# EAGLE design RFM69W-V1.0 (EAGLE 6.6.0)
ABBREV: rf1; PROJECT: RFM12B Board
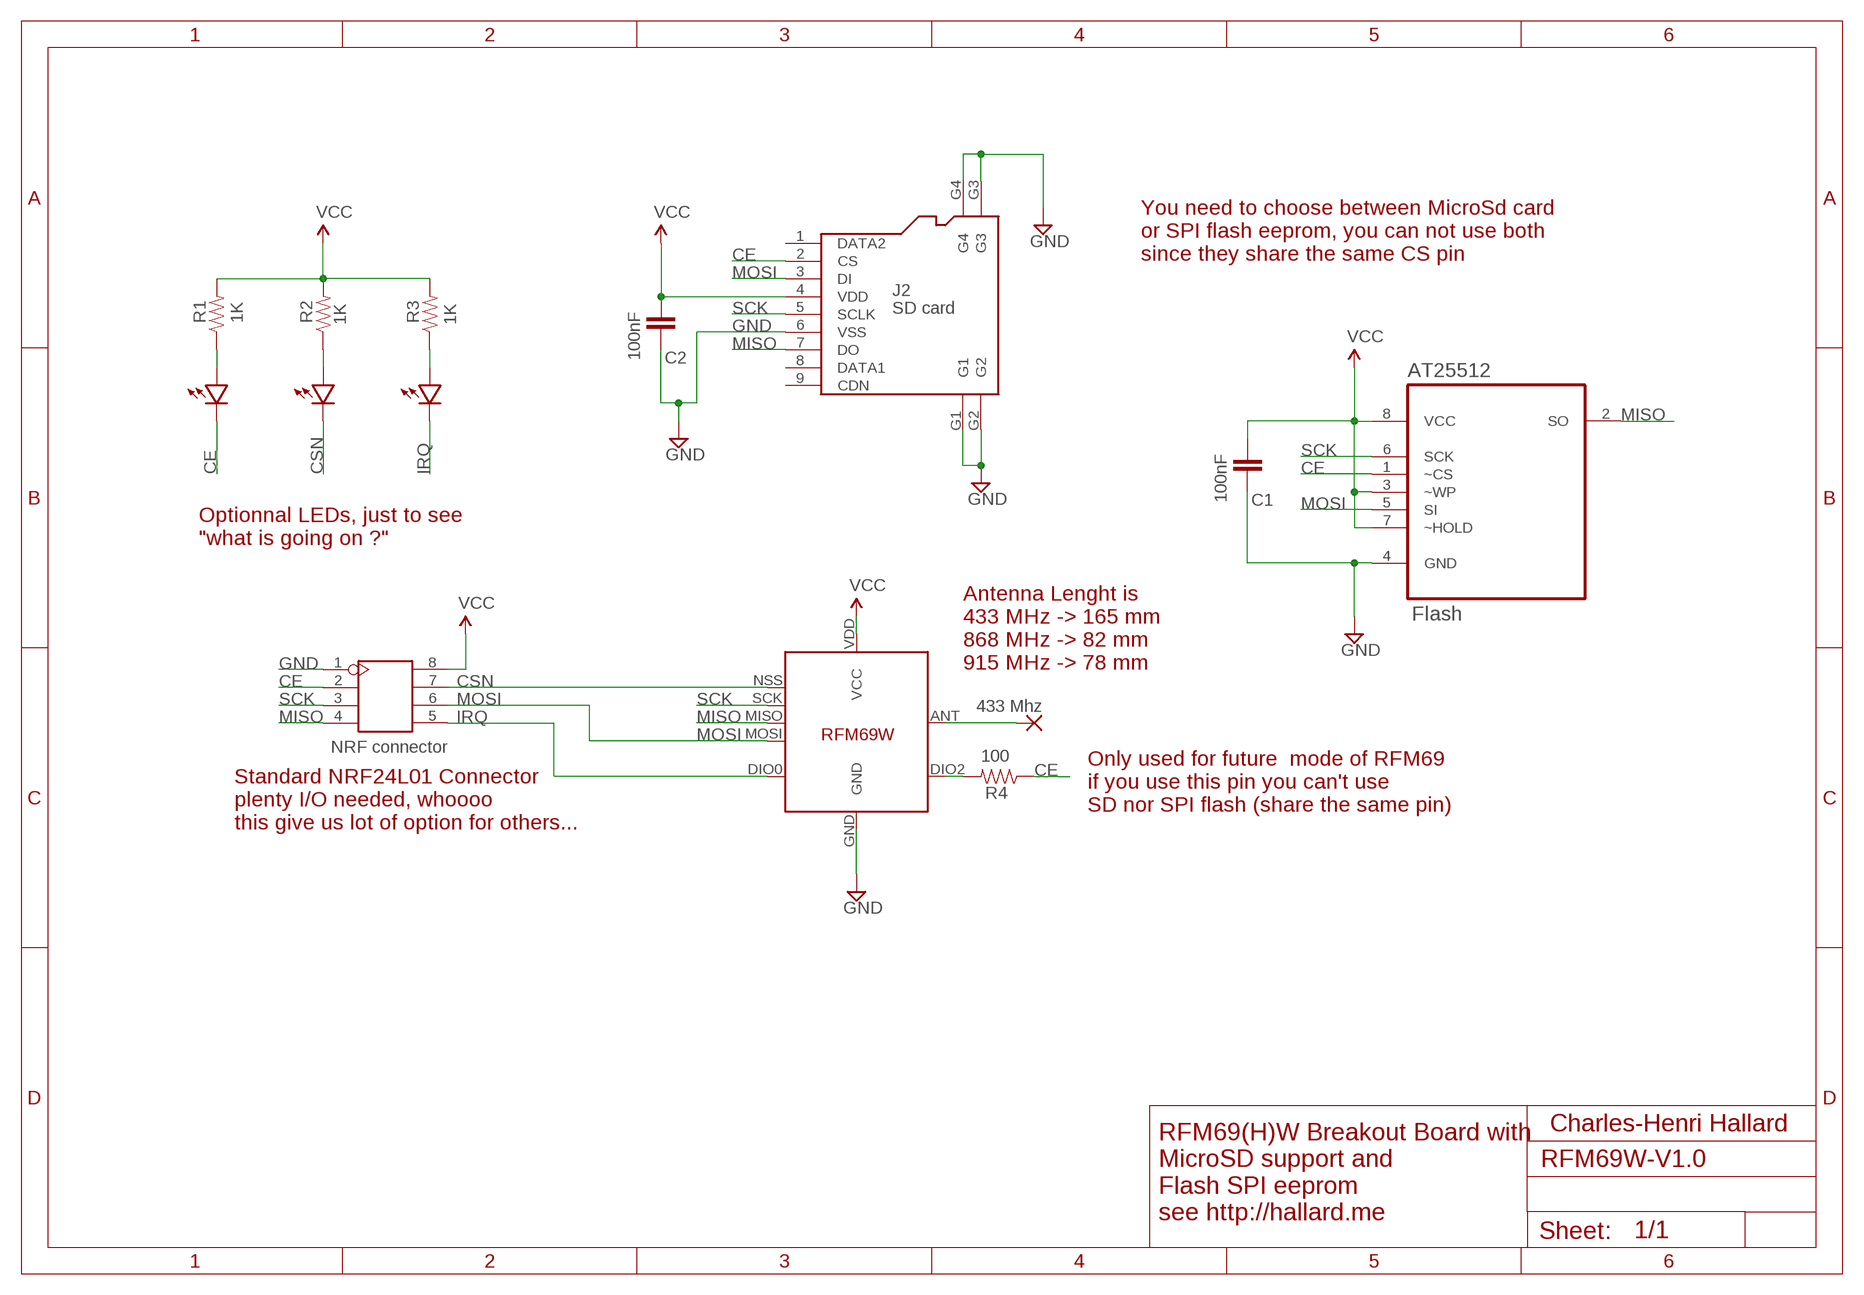
[diagram p0: schematic, sheet 1]

## Parts
ANT.  433 Mhz  1,6/0,8  [1,6/0,8]
AT25512  Flash  AT25512N-SH-B  [SOIC127P600X175-8N]
C1  100nF  CAP0805-CAP  [0805-CAP]
C2  100nF  CAP0805-CAP  [0805-CAP]
J1  NRF connector  HEADER-2X4P-2.54  [2X4P-2.54]
J2  SD card  HOLDER-MICROSD-9P  [9P-SMD-W/-RING]
R1  1K  RESISTOR0805-RES  [0805-RES]
R2  1K  RESISTOR0805-RES  [0805-RES]
R3  1K  RESISTOR0805-RES  [0805-RES]
R4  100  RESISTOR0805-RES  [0805-RES]
U$1  RFM69  [RFM69W-MINPADS]
U$2  LED0805-LARGE  [0805-LED-LARGEPADS]
U$3  LED0805-LARGE  [0805-LED-LARGEPADS]
U$4  LED0805-LARGE  [0805-LED-LARGEPADS]

## Nets
CE: AT25512.1(~CS) J1.2 J2.2(CS) R4.1 U$2.MINUS
CSN: J1.7 U$1.NSS(SEL) U$3.MINUS
GND [power]: AT25512.4(GND) C1.2 C2.2 J1.1 J2.6(VSS) J2.G1 J2.G2 J2.G3 J2.G4 U$1.GND
IRQ: J1.5 U$1.DIO0 U$4.MINUS
MISO: AT25512.2(SO) J1.4 J2.7(DO) U$1.MISO
MOSI: AT25512.5(SI) J1.6 J2.3(DI) U$1.MOSI
N$1: ANT..1(P) U$1.ANT
N$2: R1.1 U$2.PLUS
N$3: R2.1 U$3.PLUS
N$5: R3.1 U$4.PLUS
N$6: R4.2 U$1.DIO2
SCK: AT25512.6(SCK) J1.3 J2.5(SCLK) U$1.SCK
VCC [power]: AT25512.3(~WP) AT25512.7(~HOLD) AT25512.8(VCC) C1.1 C2.1 J1.8 J2.4(VDD) R1.2 R2.2 R3.2 U$1.VDD(VCC)
Unconnected: J2.1(DATA2) J2.8(DATA1) J2.9(CDN)

## Notes on the sheet
- You need to choose between MicroSd card
  or SPI flash eeprom, you can not use both
  since they share the same CS pin
- Optionnal LEDs, just to see
  "what is going on ?"
- Antenna Lenght is
  433 MHz -> 165 mm
  868 MHz -> 82 mm
  915 MHz -> 78 mm
- Only used for future  mode of RFM69
  if you use this pin you can't use 
  SD nor SPI flash (share the same pin)
- Standard NRF24L01 Connector
  plenty I/O needed, whoooo
  this give us lot of option for others...
- Charles-Henri Hallard
- RFM69(H)W Breakout Board with
  MicroSD support and
  Flash SPI eeprom
  see http://hallard.me

## Library data of the parts
ANT. = JeeLabs:1,6/0,8: THROUGH-HOLE PAD
AT25512 = Atmel_By_element14_Batch_1:AT25512N-SH-B: SPI Serial EEPROM; MPN: AT25512N-SH-B; OC_FARNELL: 1841581; OC_NEWARK: 12T1360; PACKAGE: SOIC-8; SUPPLIER: Atmel
C1 C2 = _c2h:CAP: Capacitor Standard 0603 ceramic capacitor, and 0.1" leaded capacitor.
J1 = Seeed-Connector:HEADER-2X4P
J2 = Connector:HOLDER-MICROSD-9P
R1-R4 = _c2h:RESISTOR: Resistor Basic schematic elements and footprints for 0603, 1206, and PTH resistors.
U$1 = RFM69W:RFM69
U$2-U$4 = _c2h:LED

## Net classes
1 power: width 0.203 mm, drill 0.305 mm, clearance 0.152 mm

## Board
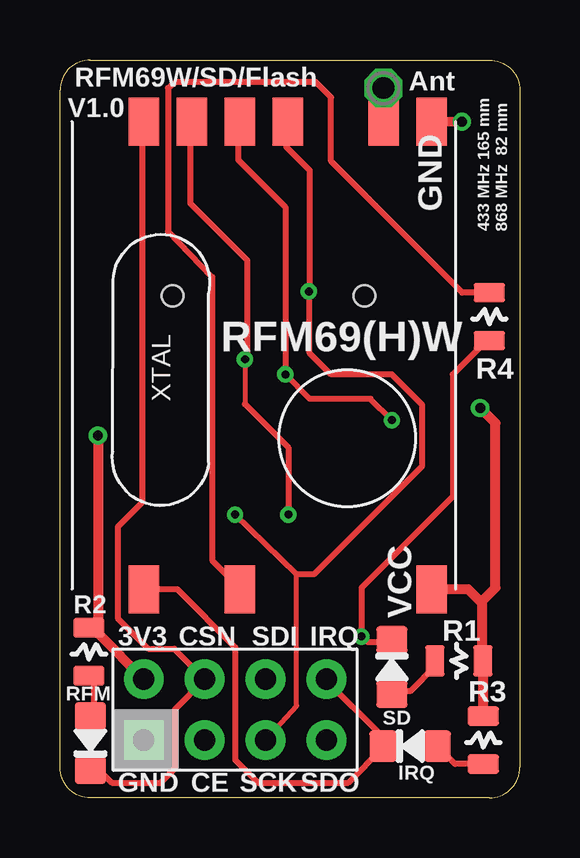
[diagram p1: board, top side]
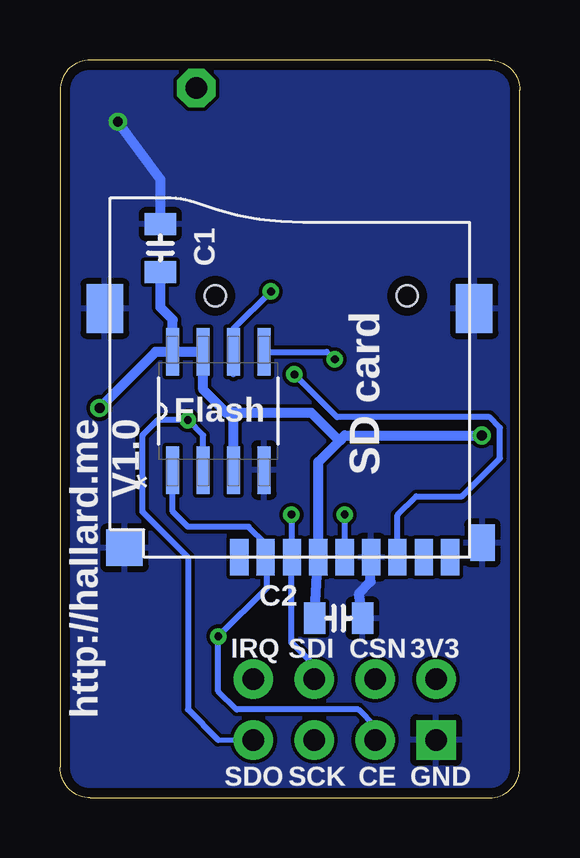
[diagram p2: board, bottom side, seen from below]

Size 19.18 x 30.77 mm. Coordinates in mm from the lower left corner, seen from the top.
Outline: 1.27,30.77 arc90 0,29.5 0,1.27 arc90 1.27,0 17.91,0 arc90 19.18,1.27 19.18,29.5 arc90 17.91,30.77 1.24,30.77
Copper layers (1*16): Top 0.0356mm / dielectric 1.5011mm / Bottom 0.0356mm
Design rules "LaenPCBOrder *": minimum track width 6mil, minimum drill 13mil, track to track 6mil, track to pad 6mil, pad to pad 6mil, via to via 6mil, smd to smd 6mil, copper to edge 15mil, drill to drill 6mil, minimum pad ring 7mil, minimum via ring 7mil, stop-mask expansion 3mil, vias tented up to drill 40mil, thermal gap 10mil

### Footprints (pad centres in the part's own frame; a part is rotated, then mirrored left to right if it is on the bottom)
1,6/0,8 = drill 0.9 pad 1.6 octagon: 1 0,0
SOIC127P600X175-8N = smd 1.981 x 0.559: 1 -2.464,1.905; 2 -2.464,0.635; 3 -2.464,-0.635; 4 -2.464,-1.905; 5 2.464,-1.905; 6 2.464,-0.635; 7 2.464,0.635; 8 2.464,1.905
0805-CAP = smd 0.902 x 1.3: 1 -1,0; 2 1,0
2X4P-2.54 = drill 0.889 pad 1.651 square: 1 -1.27,3.81 | drill 0.889 pad 1.651: 2 -1.27,1.27; 3 -1.27,-1.27; 4 -1.27,-3.81; 5 1.27,-3.81; 6 1.27,-1.27; 7 1.27,1.27; 8 1.27,3.81
9P-SMD-W/-RING = smd 1.524 x 0.762: 1 0,4.4; 2 0,3.3; 3 0,2.2; 4 0,1.1; 5 0,0; 6 0,-1.1; 7 0,-2.2; 8 0,-3.3; 9 0,-4.4 | smd 1.524 x 1.016: G1 0.6,-5.746 | smd 2.032 x 1.524: G2 10.373,-5.4; G3 10.373,10 | smd 1.524 x 1.524: G4 0.392,9.181 | hole 0.889: 10.9,-2.6; 10.9,5.4
0805-RES = smd 0.8 x 1.3: 1 -1,0; 2 1,0
RFM69W-MINPADS = smd 2 x 1.27: ANT 8,-5; DIO0 -11.5,5; DIO2 -11.5,1; GND 8,-7; MISO 8,1; MOSI 8,3; NSS 8,5; SCK 8,-1; VDD -11.5,-7
0805-LED-LARGEPADS = smd 1.156 x 1.3: MINUS -1.127,0; PLUS 1.127,0

### Placement (x,y rotation side)
ANT.  13.49,29.59 0 top
AT25512  12.57,16.13 90 bottom
C1  14.99,22.92 90 bottom
C2  7.56,7.49 0 bottom
J1  7.3,3.68 90 top
J2  7.3,10.03 90 bottom
R1  16.64,5.71 0 top
R2  1.21,6.1 90 top
R3  17.65,2.41 90 top
R4  17.91,20.07 90 top
U$1  8.51,20.19 90 top
U$2  13.84,5.46 270 top
U$3  1.27,2.29 90 top
U$4  14.6,2.16 0 top

### Tracks (layer width: path | path; a pad name or v marks a point on that pad's centre or on a via)
CE  (via drill 0.33)
  Top 0.203: 12.79,6.51 v12.57,6.73
  Top 0.254: R4.1 17.85,19.12 16.38,17.65 16.38,12.57 12.57,8.76 v12.57,6.73 | 12.79,6.51 13.84,6.51 U$2.MINUS
  Bottom 0.203: 10.54,9.97 J2.2 10.6,10.6 | J1.2 6.03,2.98
  Bottom 0.254: 10.54,9.97 10.54,8.76 v12.57,6.73 12.57,4.45 11.81,3.68 6.73,3.68 6.03,2.98 | 10.6,10.6 11.3,11.3 13.84,11.3 14.48,11.94 AT25512.1
CSN
  Top 0.203: 3.45,28.13 U$1.NSS
  Top 0.254: 3.45,28.13 3.45,12.34 2.41,11.3 2.41,7.49 3.68,6.22 4.76,6.22 J1.7 4.79,3.68 4.79,1.24 4.19,0.64 2.16,0.64 1.69,1.11 1.61,1.03 U$3.MINUS
GND  (via drill 0.41)
  Top 0.406: v16.76,28.19 15.49,28.18 U$1.GND
  Bottom 0.203: 5.97,9.52 5.97,9.8 J2.6
  Bottom 0.406: C2.2 6.71,8.53 6.22,9.02 6.22,10.01 J2.6 | C1.2 14.99,25.78 v16.76,28.19
  pour Bottom: -1.14,-1.14 -1.14,31.93 20.32,31.93 20.32,-1.14
IRQ
  Top 0.203: J1.5 11.11,4.89 | 13.33,2.67 13.33,2.38
  Top 0.254: 11.11,4.89 13.33,2.67 | U$1.DIO0 4.9,8.69 7.3,6.29 7.3,1.59 8.25,0.64 12.03,0.64 13.48,2.08 U$4.MINUS 13.48,2.24 13.33,2.38
MISO  (via drill 0.33)
  Top 0.203: 7.45,28.13 U$1.MISO
  Top 0.254: v13.84,15.75 12.95,16.64 10.41,16.64 v9.4,17.65 9.4,24.64 7.45,26.59 7.45,28.13
  Bottom 0.203: 5.08,10.01 J2.7 | 12.57,2.41 J1.4
  Bottom 0.254: AT25512.2 13.21,15.11 v13.84,15.75 15.11,15.75 15.75,15.11 15.75,11.94 13.84,10.03 13.84,3.68 12.57,2.41 | J2.7 5.1,11.79 4.32,12.57 2.41,12.57 0.83,14.16 0.83,15.43 1.27,15.87 7.62,15.87 v9.4,17.65
MOSI  (via drill 0.33)
  Top 0.203: 7.72,16.41 v7.72,18.29 7.81,18.38 | 5.45,28.13 U$1.MOSI
  Top 0.254: 7.72,16.41 9.52,14.6 v9.52,11.81 | 7.81,18.38 7.81,22.42 5.45,24.78 5.45,28.13
  Bottom 0.203: 9.52,10.01 J2.3 9.52,10.05 | 8.05,18.59 v7.72,18.29
  Bottom 0.254: J1.6 8.57,5.53 9.52,6.48 9.52,10.01 | v9.52,11.81 9.52,10.05 | AT25512.5 8.05,18.59
N$1
  Top 0.203: 13.49,28.55 13.3,27.99 | 13.3,27.99 13.18,27.59 | 13.49,28.24 13.49,28.17 13.3,27.99
  Top 0.254: ANT..1 13.49,28.24 13.49,28.21 U$1.ANT
N$2
  Top 0.203: R1.1 15.69,5.53
  Top 0.254: 15.69,5.53 14.6,4.45 13.88,4.45 13.88,4.33 U$2.PLUS
N$3
  Top 0.254: R2.1 1.4,4.78 1.4,3.41 U$3.PLUS
N$5
  Top 0.254: 15.87,2.16 U$4.PLUS 16.48,1.41 R3.1
N$6
  Top 0.254: U$1.DIO2 7.49,8.71 7.49,8.76 6.35,9.91 6.35,21.72 4.51,23.62 4.51,29.59 4.83,29.85 10.67,29.85 11.3,29.21 11.3,26.54 16.78,21.07 R4.2
SCK  (via drill 0.33)
  Top 0.203: J1.3 9.87,3.84 9.87,9.33 | 9.44,27.13 9.44,28.13 U$1.SCK
  Top 0.254: 9.44,27.13 10.41,26.16 10.41,21.15 v10.38,21.11 10.41,21.08 10.41,18.54 11.3,17.65 13.84,17.65 15.11,16.38 15.11,13.84 10.6,9.33 9.87,9.33 v7.3,11.81
  Bottom 0.203: AT25512.6 11.94,19.56
  Bottom 0.254: v7.3,11.81 J2.5 | 11.94,19.56 v10.38,21.11 | AT25512.6 11.94,17.65
VCC  (via drill 0.41)
  Top 0.203: R2.2 1.14,7.05 1.59,7.49
  Top 0.406: v1.59,15.11 1.59,7.49 1.59,6.86 J1.8 | v17.53,16.26 18.16,15.62 18.16,8.76 17.59,8.19 17.59,8.13 | 17.59,3.43 R3.2 17.64,3.43 R1.2 17.59,5.77 17.59,8.13 | 17.59,8.13 17.02,8.69 U$1.VDD
  Bottom 0.406: 7.53,14.89 8.4,14.01 J2.4 C2.1 | 7.53,14.89 7.3,15.11 v1.59,15.11 | AT25512.8 AT25512.7 13.21,17.02 12.26,16.07 11.62,16.07 | AT25512.8 15.19,18.59 v17.53,16.26 | AT25512.3 11.94,15.75 11.62,16.07 | 11.62,16.07 8.7,16.07 7.53,14.89 | AT25512.8 14.48,19.94 14.99,20.45 C1.1

### Text on the board
tNames: RFM69W/SD/Flash | Ant | V1.0 | GND | 433 MHz 165 mm / 868 MHz 82 mm | RFM69(H)W | R4 | VCC | R2 | R1 | 3V3 | CSN | SDI | IRQ | RFM | R3 | SD | IRQ | GND | CE | SCK | SDO
bNames: http://hallard.me / V1.0 | C2 | 3V3 | CSN | SDI | IRQ | GND | CE | SCK | SDO